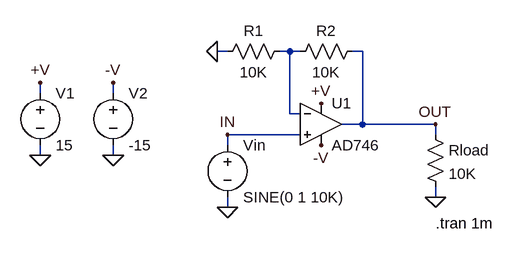
[diagram p0: schematic AD746.asc]
AD746.asc, the LTspice schematic file:
Version 4
SHEET 1 1240 700
WIRE 432 -1216 416 -1216
WIRE 528 -1216 512 -1216
WIRE 544 -1216 528 -1216
WIRE 640 -1216 624 -1216
WIRE 144 -1152 144 -1168
WIRE 256 -1152 256 -1168
WIRE 528 -1120 528 -1216
WIRE 544 -1120 528 -1120
WIRE 640 -1104 640 -1216
WIRE 640 -1104 608 -1104
WIRE 752 -1104 640 -1104
WIRE 544 -1088 432 -1088
WIRE 752 -1088 752 -1104
WIRE 432 -1072 432 -1088
WIRE 144 -1056 144 -1072
WIRE 256 -1056 256 -1072
WIRE 752 -992 752 -1008
WIRE 432 -976 432 -992
FLAG 144 -1168 +V
FLAG 144 -1056 0
FLAG 432 -976 0
FLAG 752 -1104 OUT
FLAG 432 -1088 IN
FLAG 576 -1136 +V
FLAG 256 -1168 -V
FLAG 576 -1072 -V
FLAG 416 -1216 0
FLAG 752 -992 0
FLAG 256 -1056 0
SYMBOL voltage 144 -1168 R0
WINDOW 123 0 0 Left 2
WINDOW 39 0 0 Left 2
SYMATTR InstName V1
SYMATTR Value 15
SYMBOL voltage 432 -1088 R0
WINDOW 123 24 146 Left 2
WINDOW 39 24 125 Left 2
SYMATTR InstName Vin
SYMATTR Value SINE(0 1 10K)
SYMBOL res 528 -1232 R90
WINDOW 0 0 56 VBottom 2
WINDOW 3 32 56 VTop 2
SYMATTR InstName R1
SYMATTR Value 10K
SYMBOL res 640 -1232 R90
WINDOW 0 0 56 VBottom 2
WINDOW 3 32 56 VTop 2
SYMATTR InstName R2
SYMATTR Value 10K
SYMBOL voltage 256 -1168 R0
WINDOW 123 24 146 Left 2
WINDOW 39 24 125 Left 2
SYMATTR InstName V2
SYMATTR Value -15
SYMBOL res 736 -1104 R0
SYMATTR InstName Rload
SYMATTR Value 10K
SYMBOL AD746 576 -1168 R0
SYMATTR InstName U1
TEXT 752 -952 Left 2 !.tran 1m

The netlist it stands for:
* AD746.asc
V1 +V 0 15
Vin IN 0 SINE(0 1 10K)
R1 N001 0 10K
R2 OUT N001 10K
V2 -V 0 -15
Rload OUT 0 10K
* U1: AD746 (symbol AD746 not available, pins judged from their places): In+=IN In-=N001 V+=+V V-=-V OUT=OUT
.tran 1m
.backanno
.end